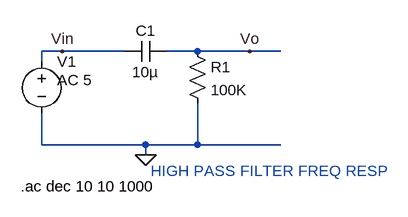
[diagram p0: schematic HIGH PASS FILTER FREQ RESPONSE.asc]
HIGH PASS FILTER FREQ RESPONSE.asc, the LTspice schematic file:
Version 4
SHEET 1 880 680
WIRE 0 128 -32 128
WIRE 96 128 0 128
WIRE 208 128 160 128
WIRE 288 128 208 128
WIRE 336 128 288 128
WIRE -32 144 -32 128
WIRE -32 272 -32 224
WIRE 128 272 -32 272
WIRE 208 272 208 208
WIRE 208 272 128 272
WIRE 336 272 208 272
WIRE 128 288 128 272
FLAG 128 288 0
FLAG 288 128 Vo
FLAG 0 128 Vin
SYMBOL res 192 112 R0
SYMATTR InstName R1
SYMATTR Value 100K
SYMBOL cap 96 144 R270
WINDOW 0 32 32 VTop 2
WINDOW 3 0 32 VBottom 2
SYMATTR InstName C1
SYMATTR Value 10µ
SYMBOL voltage -32 128 R0
WINDOW 3 -131 108 Left 2
WINDOW 123 24 44 Left 2
WINDOW 39 0 0 Left 2
SYMATTR Value ""
SYMATTR Value2 AC 5
SYMATTR InstName V1
TEXT 136 312 Left 2 ;HIGH PASS FILTER FREQ RESP
TEXT -64 336 Left 2 !.ac dec 10 10 1000

The netlist it stands for:
* HIGH PASS FILTER FREQ RESPONSE.asc
R1 Vo 0 100K
C1 Vin Vo 10µ
V1 Vin 0 AC 5
* HIGH PASS FILTER FREQ RESP
.ac dec 10 10 1000
.backanno
.end

* Results of the author's LTspice run, read from the files saved beside the schematic
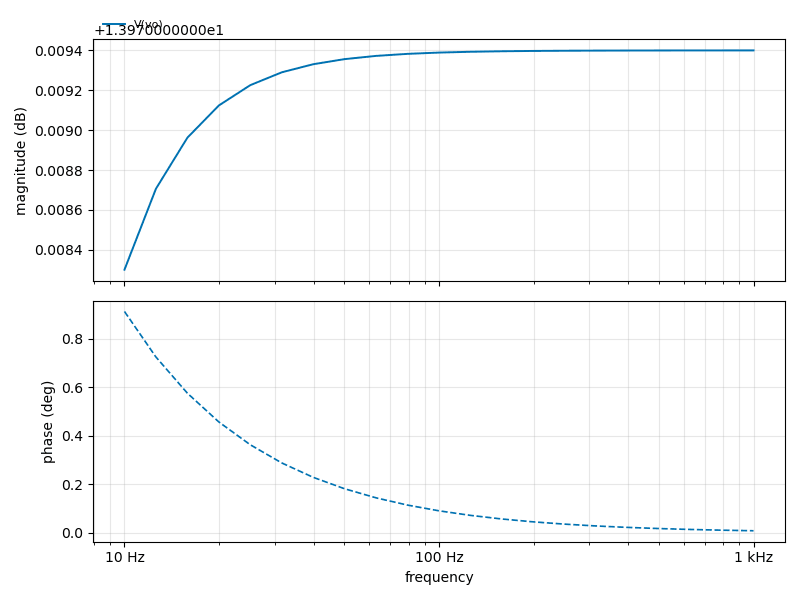
[diagram p1: AC Analysis of HIGH PASS FILTER FREQ RESPONSE.asc, plotted from the saved traces]
* AC Analysis, 1 run:
*   V(vo): 13.98 dB at 10 Hz, 13.98 dB at 1 kHz, peak 13.98 dB at 1 kHz